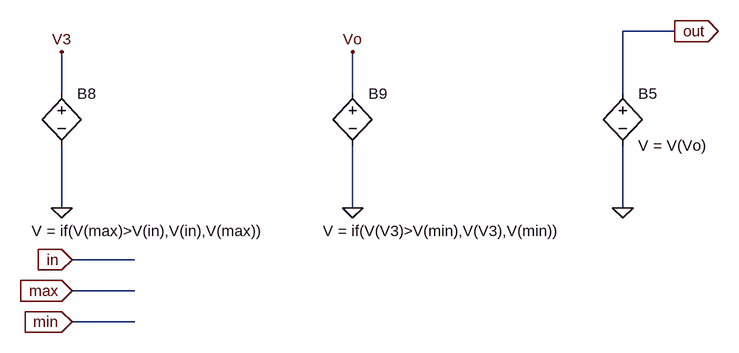
[diagram p0: schematic Clamp.asc]
Clamp.asc, the LTspice schematic file:
Version 4
SHEET 1 1072 680
WIRE 976 -720 896 -720
WIRE 32 -624 32 -688
WIRE 480 -624 480 -688
WIRE 896 -624 896 -720
WIRE 32 -448 32 -544
WIRE 480 -448 480 -544
WIRE 896 -448 896 -544
WIRE 144 -368 48 -368
WIRE 144 -320 48 -320
WIRE 144 -272 48 -272
FLAG 48 -368 in
IOPIN 48 -368 In
FLAG 48 -320 max
IOPIN 48 -320 In
FLAG 48 -272 min
IOPIN 48 -272 In
FLAG 896 -448 0
FLAG 976 -720 out
IOPIN 976 -720 Out
FLAG 32 -448 0
FLAG 32 -688 V3
FLAG 480 -448 0
FLAG 480 -688 Vo
SYMBOL bv 896 -640 R0
SYMATTR InstName B5
SYMATTR Value V = V(Vo)
SYMBOL bv 32 -640 R0
WINDOW 3 -46 228 Left 0
SYMATTR Value V = if(V(max)>V(in),V(in),V(max))
SYMATTR InstName B8
SYMBOL bv 480 -640 R0
WINDOW 3 -46 228 Left 0
SYMATTR Value V = if(V(V3)>V(min),V(V3),V(min))
SYMATTR InstName B9

The netlist it stands for:
* Clamp.asc
B5 out 0 V = V(Vo)
B8 V3 0 V = if(V(max)>V(in),V(in),V(max))
B9 Vo 0 V = if(V(V3)>V(min),V(V3),V(min))
.backanno
.end